# Altium schematic sheet STORAGE.SchDoc: SD CARD
size 420 x 297 mm; SheetNumber: 5
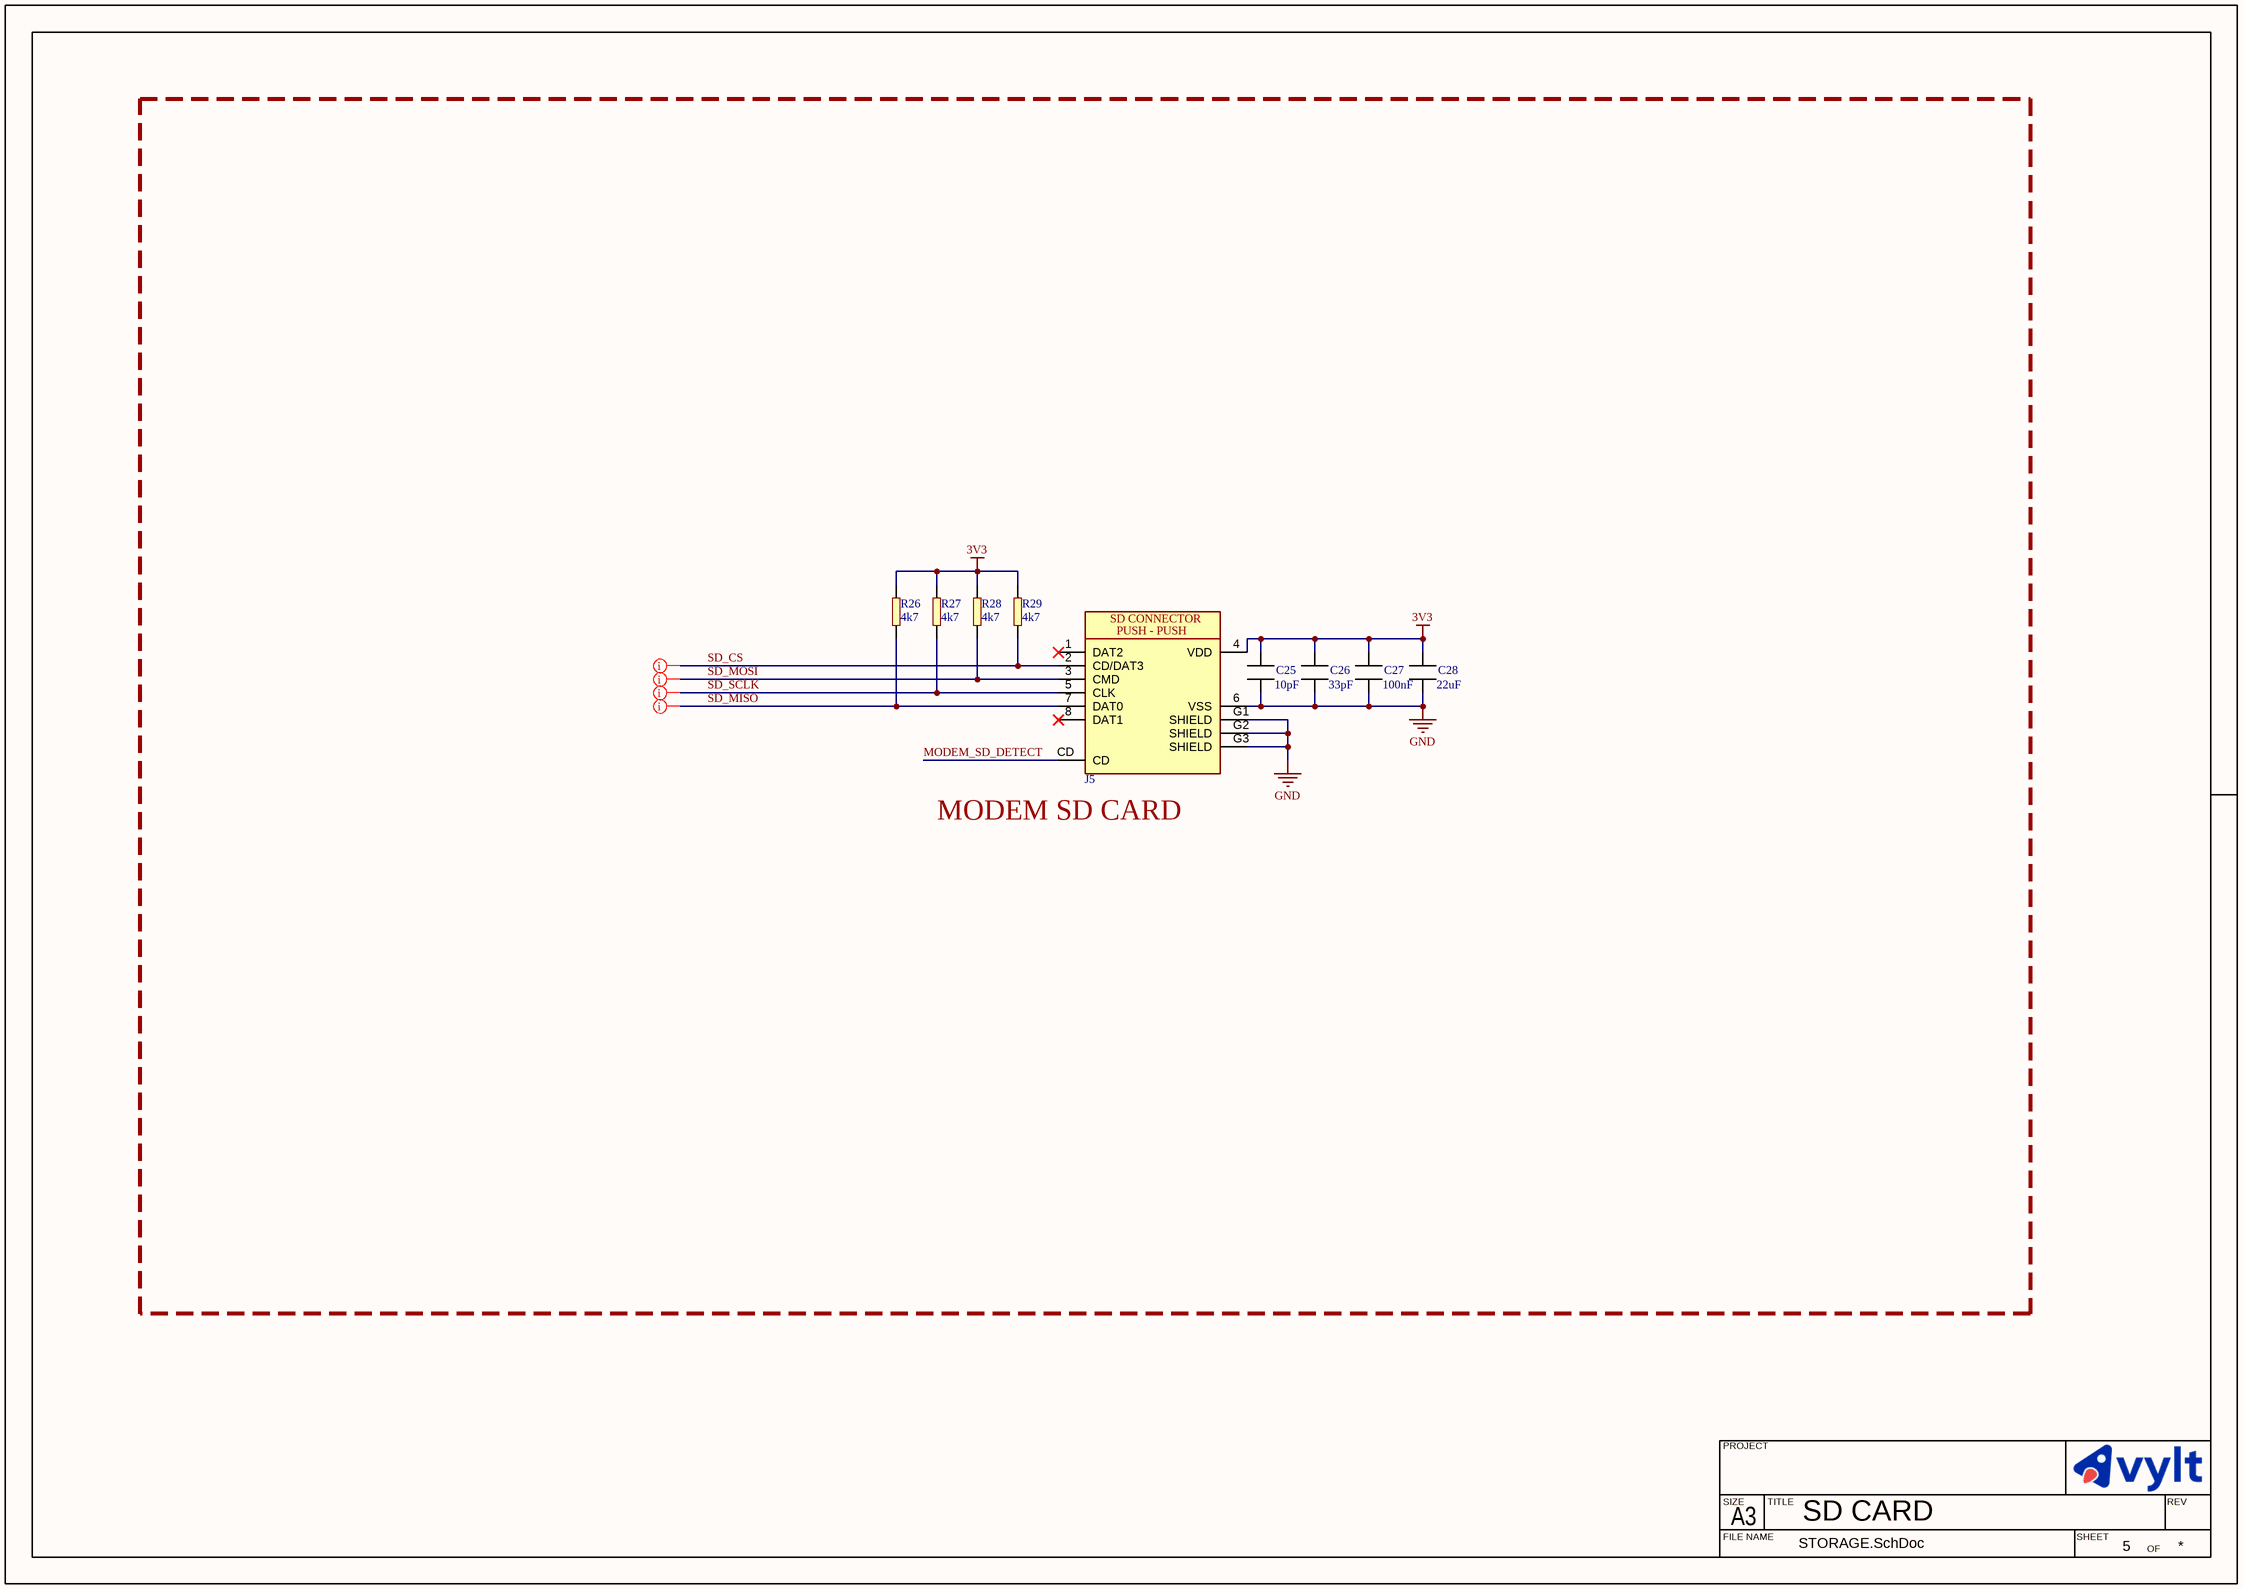
[diagram p0: STORAGE.SchDoc]

## Parts
C25  value 10pF  [CAPC2012X13L]  (hidden comment: MLCC_0805)
C26  value 33pF  [CAPC2012X13L]  (hidden comment: MLCC_0805)
C27  value 100nF  [CAPC2012X13L]  (hidden comment: MLCC_0805)
C28  value 22uF  [CAPC2012X13L]  (hidden comment: MLCC_0805)
J5  GTFP084  [GTFP084]  (value not drawn)
R26  value 4k7  [RES_0603]  (hidden comment: ERP_101-1)
R27  value 4k7  [RES_0603]  (hidden comment: ERP_101-1)
R28  value 4k7  [RES_0603]  (hidden comment: ERP_101-1)
R29  value 4k7  [RES_0603]  (hidden comment: ERP_101-1)

## Blocks framed on the sheet
MODEM SD CARD: C25-C28 J5 R26-R29

## Nets
3V3: C25.1 C26.1 C27.1 C28.1 J5.4(VDD) R26.2 R27.2 R28.2 R29.2
GND: C25.2 C26.2 C27.2 C28.2 J5.6(VSS) J5.G1(SHIELD) J5.G2(SHIELD) J5.G3(SHIELD)
MODEM_SD_DETECT: J5.CD
SD_CS: J5.2(CD/DAT3) R29.1
SD_MISO: J5.7(DAT0) R26.1
SD_MOSI: J5.3(CMD) R28.1
SD_SCLK: J5.5(CLK) R27.1

Not connected (* = marked no-connect by the designer): J5 1(DAT2)* 8(DAT1)*

## Layout directives
rule Width Constraint [Pref Impedance = 50.00ohms    Min Impedance = 50.00ohms    Max Impedance = 50.00ohms]: SD_CS, SD_MISO, SD_MOSI, SD_SCLK

## Notes on the sheet
- PROJECT
- SIZE
- FILE NAME
- A3
- TITLE
- SHEET
- OF
- REV
- (in symbol GTFP084) SD CONNECTOR; PUSH - PUSH

## Library data of the parts
C25-C28 = MLCC_0805: Chip Capacitor, 2-Leads, Body 2.00x1.25mm, IPC High Density; Package: 0805; Manufacturer 1: *; Manufacturer Part Number 1: *
J5 = GTFP084: 9 (8 + 1) Position Card Connector Secure Digital - microSD™ Surface Mount, Right Angle Gold; Manufacturer Part Number 1: GTFP08431BEU; Manufacturer 1: Amphenol; Package: 9 (8+1); Value: *; Supplier Part Number 1: 6172
R26-R29 = RES_0603: Package: 0603; Manufacturer 1: *; Manufacturer Part Number 1: *